# Altium schematic sheet HIVE_BOARD_ETHERNET.SchDoc
size Tabloid; SheetNumber: 9; SheetTotal: 12; Size: 11x17; Sheet_Name: ETHERNET
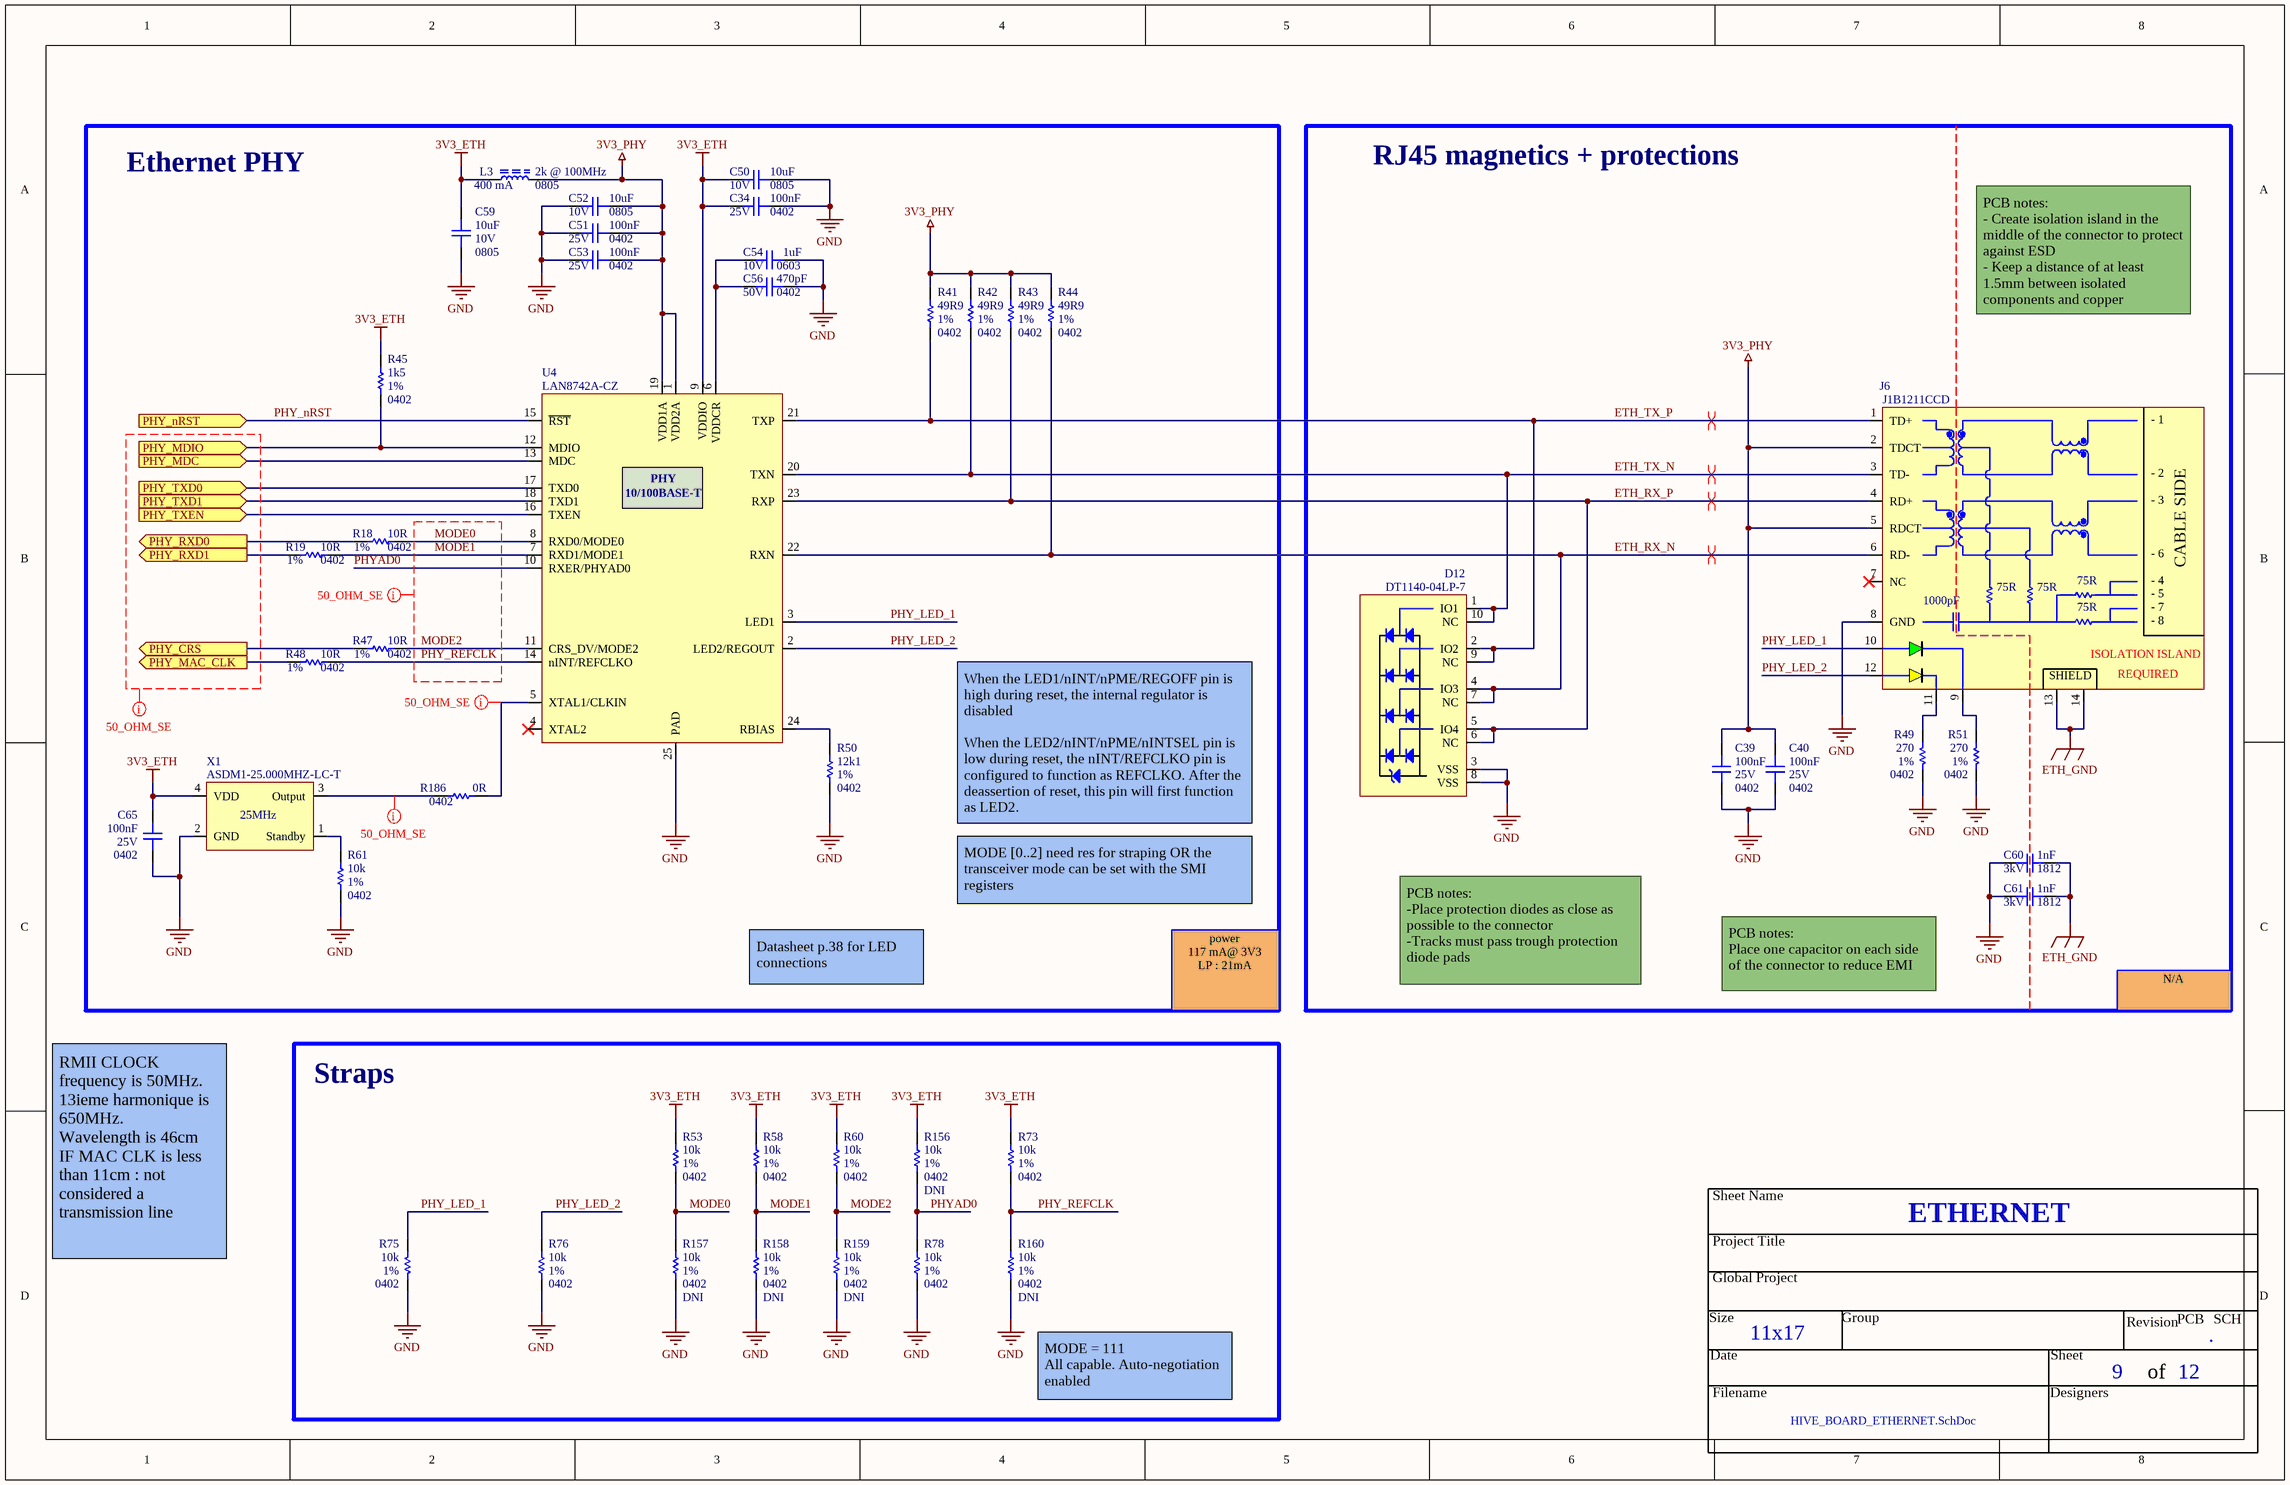
[diagram p0: HIVE_BOARD_ETHERNET.SchDoc]

## Parts
C34  value 100nF  Package: 0402  Voltage Rating: 25V  [CAP_CER_0402]  (hidden comment: CGA2B3X7R1E104K050BB)
C39  value 100nF  Package: 0402  Voltage Rating: 25V  [CAP_CER_0402]  (hidden comment: CGA2B3X7R1E104K050BB)
C40  value 100nF  Package: 0402  Voltage Rating: 25V  [CAP_CER_0402]  (hidden comment: CGA2B3X7R1E104K050BB)
C50  value 10uF  Package: 0805  Voltage Rating: 10V  [CAP_CER_0805]  (hidden comment: LMK212BJ106KG-T)
C51  value 100nF  Package: 0402  Voltage Rating: 25V  [CAP_CER_0402]  (hidden comment: CGA2B3X7R1E104K050BB)
C52  value 10uF  Package: 0805  Voltage Rating: 10V  [CAP_CER_0805]  (hidden comment: LMK212BJ106KG-T)
C53  value 100nF  Package: 0402  Voltage Rating: 25V  [CAP_CER_0402]  (hidden comment: CGA2B3X7R1E104K050BB)
C54  value 1uF  Package: 0603  Voltage Rating: 10V  [CAP_CER_0603]  (hidden comment: C0603C105K8PACTU)
C56  value 470pF  Package: 0402  Voltage Rating: 50V  [CAP_CER_0402]  (hidden comment: CC0402KRX7R9BB471)
C59  value 10uF  Package: 0805  Voltage Rating: 10V  [CAP_CER_0805]  (hidden comment: LMK212BJ106KG-T)
C60  value 1nF  Package: 1812  Voltage Rating: 3kV  [CAP_CER_1812]  (hidden comment: 885342211009)
C61  value 1nF  Package: 1812  Voltage Rating: 3kV  [CAP_CER_1812]  (hidden comment: 885342211009)
C65  value 100nF  Package: 0402  Voltage Rating: 25V  [CAP_CER_0402]  (hidden comment: CGA2B3X7R1E104K050BB)
D12  DT1140-04LP-7  [TVS_DATA_DT1140-04LP-7]
J6  J1B1211CCD  [CON_ETH_J1B1211CCD_WIZ]
L3  value 2k @ 100MHz  Current Rating: 400 mA  Package: 0805  [FER_0805]  (hidden comment: MMZ2012Y202BT000)
R18  value 10R  Tolerance: 1%  Package: 0402  [RES_0402]  (hidden comment: RMCF0402FT10R0)
R19  value 10R  Tolerance: 1%  Package: 0402  [RES_0402]  (hidden comment: RMCF0402FT10R0)
R41  value 49R9  Tolerance: 1%  Package: 0402  [RES_0402]  (hidden comment: RC0402FR-0749R9L)
R42  value 49R9  Tolerance: 1%  Package: 0402  [RES_0402]  (hidden comment: RC0402FR-0749R9L)
R43  value 49R9  Tolerance: 1%  Package: 0402  [RES_0402]  (hidden comment: RC0402FR-0749R9L)
R44  value 49R9  Tolerance: 1%  Package: 0402  [RES_0402]  (hidden comment: RC0402FR-0749R9L)
R45  value 1k5  Tolerance: 1%  Package: 0402  [RES_0402]  (hidden comment: RC0402FR-071K5L)
R47  value 10R  Tolerance: 1%  Package: 0402  [RES_0402]  (hidden comment: RMCF0402FT10R0)
R48  value 10R  Tolerance: 1%  Package: 0402  [RES_0402]  (hidden comment: RMCF0402FT10R0)
R49  value 270  Tolerance: 1%  Package: 0402  [FER_0402]  (hidden comment: RC0402FR-07270RL)
R50  value 12k1  Tolerance: 1%  Package: 0402  [RES_0402]  (hidden comment: RC0402FR-0712K1L)
R51  value 270  Tolerance: 1%  Package: 0402  [FER_0402]  (hidden comment: RC0402FR-07270RL)
R53  value 10k  Tolerance: 1%  Package: 0402  [RES_0402]  (hidden comment: RC0402FR-0710KL)
R58  value 10k  Tolerance: 1%  Package: 0402  [RES_0402]  (hidden comment: RC0402FR-0710KL)
R60  value 10k  Tolerance: 1%  Package: 0402  [RES_0402]  (hidden comment: RC0402FR-0710KL)
R61  value 10k  Tolerance: 1%  Package: 0402  [RES_0402]  (hidden comment: RC0402FR-0710KL)
R73  value 10k  Tolerance: 1%  Package: 0402  [RES_0402]  (hidden comment: RC0402FR-0710KL)
R75  value 10k  Tolerance: 1%  Package: 0402  [RES_0402]  (hidden comment: RC0402FR-0710KL)
R76  value 10k  Tolerance: 1%  Package: 0402  [RES_0402]  (hidden comment: RC0402FR-0710KL)
R78  value 10k  Tolerance: 1%  Package: 0402  [RES_0402]  (hidden comment: RC0402FR-0710KL)
R156  value 10k  Tolerance: 1%  Assembly Note: DNI  Package: 0402  [RES_0402]  (hidden comment: RC0402FR-0710KL)
R157  value 10k  Tolerance: 1%  Assembly Note: DNI  Package: 0402  [RES_0402]  (hidden comment: RC0402FR-0710KL)
R158  value 10k  Tolerance: 1%  Assembly Note: DNI  Package: 0402  [RES_0402]  (hidden comment: RC0402FR-0710KL)
R159  value 10k  Tolerance: 1%  Assembly Note: DNI  Package: 0402  [RES_0402]  (hidden comment: RC0402FR-0710KL)
R160  value 10k  Tolerance: 1%  Assembly Note: DNI  Package: 0402  [RES_0402]  (hidden comment: RC0402FR-0710KL)
R186  value 0R  Package: 0402  [RES_0402]  (hidden comment: RC0402FR-070RL)
U4  LAN8742A-CZ  [COM_ETH_LAN8742A-CZ-TR]
X1  ASDM1-25.000MHZ-LC-T  [OSC_CRY_ASDM1-25.000MHZ-LC-T]

## Blocks framed on the sheet
Ethernet PHY: C34 C50-C54 C56 C59 C65 L3 R18 R19 R41-R45 R47 R48 R50 R61 R186 U4 X1
RJ45 magnetics + protections: C39 C40 C60 C61 D12 J6 R49 R51
Straps: R53 R58 R60 R73 R75 R76 R78 R156-R160

## Ports
PHY_CRS (out), PHY_MAC_CLK (out), PHY_MDC (in), PHY_MDIO (in), PHY_nRST (in), PHY_RXD0 (out), PHY_RXD1 (out), PHY_TXD0 (in), PHY_TXD1 (in), PHY_TXEN (in)

## Nets
3V3_ETH: C34.2 C50.2 C59.2 C65.1 L3.1 R45.2 R53.2 R58.2 R60.2 R73.2 R156.2 U4.9(VDDIO) X1.4(VDD)
3V3_PHY: C39.1 C40.1 C51.1 C52.1 C53.1 J6.2(TDCT) J6.5(RDCT) L3.2 R41.2 R42.2 R43.2 R44.2 U4.1(VDD2A) U4.19(VDD1A)
ETH_GND: C60.1 C61.1 J6.13(SHIELD) J6.14
GND: C34.1 C39.2 C40.2 C50.1 C51.2 C52.2 C53.2 C54.1 C56.1 C59.1 C60.2 C61.2 C65.2 D12.3(VSS) D12.8(VSS) J6.8(GND) R49.1 R50.1 R51.1 R61.1 R75.1 R76.1 R78.1 R157.1 R158.1 R159.1 R160.1 U4.25(PAD) X1.2(GND)
ETH_RX_N: D12.4(IO3) D12.7(NC) J6.6(RD-) R44.1 U4.22(RXN)
ETH_RX_P: D12.5(IO4) D12.6(NC) J6.4(RD+) R43.1 U4.23(RXP)
ETH_TX_N: D12.1(IO1) D12.10(NC) J6.3(TD-) R42.1 U4.20(TXN)
ETH_TX_P: D12.2(IO2) D12.9(NC) J6.1(TD+) R41.1 U4.21(TXP)
MODE0: R18.1 R53.1 R157.2 U4.8(RXD0/MODE0)
MODE1: R19.1 R58.1 R158.2 U4.7(RXD1/MODE1)
MODE2: R47.1 R60.1 R159.2 U4.11(CRS_DV/MODE2)
PHY_CRS: R47.2 ; port PHY_CRS
PHY_LED_1: J6.10(LED1_A) R75.2 U4.3(LED1)
PHY_LED_2: J6.12 R76.2 U4.2(LED2/REGOUT)
PHY_MAC_CLK: R48.2 ; port PHY_MAC_CLK
PHY_MDC: U4.13(MDC) ; port PHY_MDC
PHY_MDIO: R45.1 U4.12(MDIO) ; port PHY_MDIO
PHY_nRST: U4.15(~{RST}) ; port PHY_nRST
PHY_REFCLK: R48.1 R73.1 R160.2 U4.14(nINT/REFCLKO)
PHY_RXD0: R18.2 ; port PHY_RXD0
PHY_RXD1: R19.2 ; port PHY_RXD1
PHY_TXD0: U4.17(TXD0) ; port PHY_TXD0
PHY_TXD1: U4.18(TXD1) ; port PHY_TXD1
PHY_TXEN: U4.16(TXEN) ; port PHY_TXEN
PHYAD0: R78.2 R156.1 U4.10(RXER/PHYAD0)
NetC54_2: C54.2 C56.2 U4.6(VDDCR)
NetJ6_9: J6.9(LED1_K) R51.2
NetJ6_11: J6.11 R49.2
NetR50_2: R50.2 U4.24(RBIAS)
NetR61_2: R61.2 X1.1(Standby)
NetR186_1: R186.1 U4.5(XTAL1/CLKIN)
NetR186_2: R186.2 X1.3(Output)

Not connected (* = marked no-connect by the designer): J6 7(NC)*; U4 4(XTAL2)*

## Layout directives
differential pair; differential pair class DIFF_100: ETH_RX_N, ETH_RX_P, ETH_TX_N, ETH_TX_P
net class SE_50: (no net found under the mark), MODE0, MODE1, MODE2, NetR186_1, NetR186_2, PHY_REFCLK

## Notes on the sheet
- PCB notes:
  - Create isolation island in the middle of the connector to protect against ESD
  - Keep a distance of at least 1.5mm between isolated components and copper
- When the LED1/nINT/nPME/REGOFF pin is high during reset, the internal regulator is disabled
  When the LED2/nINT/nPME/nINTSEL pin is low during reset, the nINT/REFCLKO pin is configured to function as REFCLKO. After the deassertion of reset, this pin will first function as LED2.
- MODE [0..2] need res for straping OR the transceiver mode can be set with the SMI registers
- Datasheet p.38 for LED connections
- power
  117 mA@ 3V3
  LP : 21mA
- PCB notes:
  -Place protection diodes as close as possible to the connector
  -Tracks must pass trough protection diode pads
- PCB notes:
  Place one capacitor on each side of the connector to reduce EMI
- N/A
- RMII CLOCK frequency is 50MHz. 13ieme harmonique is 650MHz.
  Wavelength is 46cm
  IF MAC CLK is less than 11cm : not considered a transmission line
- MODE = 111
  All capable. Auto-negotiation enabled
- Sheet Name
- Project Title
- Global Project
- Size
- Date
- Group
- Sheet
- Revision
- of
- PCB
- .
- SCH
- Filename
- Designers
- (in symbol COM_ETH_LAN8742A-CZ) PHY; 10/100BASE-T
- (in symbol CON_ETH_J1B1211CCD) - 1; - 2; - 3; - 6; CABLE SIDE; 75R; - 4; - 5; 1000pF; - 7; - 8; ISOLATION ISLAND; REQUIRED
- (in symbol OSC_CRY_ASDM1-25.000MHZ-LC-T) 25MHz

## Library data of the parts
C34 C39 C40 C51 C53 C65 = CAP_CER_CGA2B3X7R1E104K050BB: CAP - CER 0.1µF 10% 25V X7R - 0402; Manufacturer #1: TDK Corporation; GRAMS Lib Spec: 2.8; Magnetic Material: Unknown; Polarized: NO; Assembly Type: SMD; CreatedBy/Date: Nicolas Roy 2018-11-07; Current Rating: *; HelpURL: https://product.tdk.com/info/en/catalog/datasheets/mlcc_automotive_general_en.pdf; Manufacturer #2: *; Note: *; Part Number #1: CGA2B3X7R1E104K050BB; Part Number #2: *; Power Max: *; Temperature: -55°C ~ 125°C; Tolerance: 10%; VerifiedBy: Nicolas V. (2019-01-22); Supplier 1: Digi-Key; Supplier Part Number 1: 445-6902-1-ND; Cryo: UNKNOWN
C50 C52 C59 = CAP_CER_LMK212BJ106KG-T: CAP - CER 10UF 10% 10V X5R - 0805; Manufacturer #1: Taiyo Yuden; GRAMS Lib Spec: 2.8; Magnetic Material: Unknown; Polarized: NO; Assembly Type: SMD; CreatedBy/Date: Caroline Paulin / 25 juillet 2018; Current Rating: *; HelpURL: https://www.yuden.co.jp/productdata/catalog/mlcc_all_e.pdf; Manufacturer #2: *; Note: *; Part Number #1: LMK212BJ106KG-T; Part Number #2: *; Power Max: *; Temperature: -55°C ~ 85°C; Tolerance: 10%; VerifiedBy: Nicolas V. (2019-01-22); Supplier 1: Digi-Key; Supplier Part Number 1: 587-1300-1-ND; Cryo: UNKNOWN
C54 = CAP_CER_C0603C105K8PACTU: CAP - CER 1uF 10V 10% X5R - 0603; Manufacturer #1: KEMET; GRAMS Lib Spec: 2.8; Magnetic Material: Unknown; Polarized: NO; Tolerance: 10%; Current Rating: *; Power Max: *; HelpURL: https://content.kemet.com/datasheets/KEM_C1006_X5R_SMD.pdf; CreatedBy/Date: Hubert Dube - 21/07/20; VerifiedBy: Louis-Daniel Gaulin - 21/07/20; Temperature: -55°C ~ 85°C; Manufacturer #2: *; Assembly Type: SMD; Part Number #2: *; Part Number #1: C0603C105K8PACTU; Cryo: UNKNOWN; Supplier 1: Digi-Key; Supplier Part Number 1: 399-3118-1-ND
C56 = CAP_CER_CC0402KRX7R9BB471: CAP - CER 470pF 10% 50V X7R - 0402; Manufacturer #1: Yageo; GRAMS Lib Spec: 2.8; Magnetic Material: Unknown; Polarized: NO; Assembly Type: SMD; CreatedBy/Date: Nicolas Roy 2018-10-17; Current Rating: *; HelpURL: http://www.yageo.com/documents/recent/UPY-GPHC_X7R_6.3V-to-50V_18.pdf; Manufacturer #2: *; Part Number #1: CC0402KRX7R9BB471; Part Number #2: *; Power Max: *; Temperature: -55°C ~ 125°C; Tolerance: 10%; VerifiedBy: Caroline Paulin - 18 janv 2019; Supplier 1: Digi-Key; Supplier Part Number 1: 311-1028-1-ND; Cryo: UNKNOWN
C60 C61 = CAP_CER_885342211009: CAP - CER 1000pF ±10% 3000V X7R; Manufacturer #1: Würth Elektronik; GRAMS Lib Spec: 2.8; Magnetic Material: Unknown; Polarized: No; Tolerance: 10%; Current Rating: *; Power Max: *; HelpURL: https://www.we-online.de/katalog/datasheet/885342211009.pdf; CreatedBy/Date: Hubert Dube - 03/02/2021; VerifiedBy: Philippe Asenault - 08-02-2021; Temperature: -55°C ~ 125°C; Manufacturer #2: *; Note: *; Assembly Type: SMD; Part Number #2: *; Part Number #1: 885342211009; Cryo: UNKNOWN; Supplier 1: Digi-Key; Supplier Part Number 1: 732-12109-1-ND
D12 = TVS_DATA_DT1140-04LP-7: TVS - DIODE 5.5V 10V - 10-UFDFN; Manufacturer #1: Diodes Incorporated; Value: 5.5V @ 1mA (Reverse Standoff); Voltage Rating: 6V (Breakdown); Current Rating: 6A (8/20µs); Power Max: 60W (8/20µs); GRAMS Lib Spec: 2.8; Note: Fooprint created from tpd4e05u06 (TI) for manufacturability (soldermask); Magnetic Material: UNKNOWN; Polarized: Yes; Tolerance: -; HelpURL: https://www.diodes.com/assets/Datasheets/DT1140-04LP.pdf; CreatedBy/Date: Joël Lemay 2019-11-20; VerifiedBy: C.Paulin - 21/11/2019; Temperature: -55°C~85°C; Package: 10-UFDFN; Manufacturer #2: -; Assembly Type: SMD; Part Number #2: -; Part Number #1: DT1140-04LP-7; Supplier 1: Digi-Key; Supplier Part Number 1: DT1140-04LP-7DICT-ND; Cryo: UNKNOWN; Solder Paste Type: UNKNOWN; Stencil Thickness (Recommended): UNKNOWN
J6 = CON_ETH_J1B1211CCD: CON_ETH - 1 Port RJ45 Magjack Connector Through Hole 10/100 Base-T, AutoMDIX / 350 µH minimum OCL with 8 mA bias current.; Manufacturer #1: WIZnet; Part Number #1: 1278-1052-ND; GRAMS Lib Spec: 2.8; Magnetic Material: Unknown; Polarized: Yes; Tolerance: *; Voltage Rating: *; Power Max: *; HelpURL: http://wizwiki.net/wiki/lib/exe/fetch.php?media=products:wiz550web:wiz550webds_kr:j1b1211ccd.pdf; CreatedBy/Date: Hubert Dube - 12/02/2021; VerifiedBy: Philippe Arsenault - 2021-03-10; Temperature: -40°C ~ 85°C; Assembly Type: SMD; Part Number #2: *; Cryo: UNKNOWN; Supplier 1: Digi-Key; Supplier Part Number 1: 1278-1052-ND
L3 = FER_MMZ2012Y202BT000: FER - FERRITE BEAD 2 KOHM @ 100 MHz 400 mA - 0805; Manufacturer #1: TDK Corporation; GRAMS Lib Spec: 2.8; Magnetic Material: Unknown; Polarized: No; Tolerance: *; Voltage Rating: *; Power Max: *; HelpURL: https://product.tdk.com/info/en/catalog/datasheets/beads_commercial_signal_mmz2012_en.pdf; CreatedBy/Date: Hubert Dube - 7/02/2021; VerifiedBy: Philippe Arsenault/ 2021-03-13; Temperature: -55°C ~ 125°C; Assembly Type: SMD; Part Number #2: *; Part Number #1: MMZ2012Y202BT000; Cryo: UNKNOWN; Supplier 1: Digi-Key; Supplier Part Number 1: 445-1561-1-ND
R18 R19 R47 R48 = RES_RMCF0402FT10R0: RES - 10R 1% 1/16W - 0402; Manufacturer #1: Stackpole Electronics Inc.; Current Rating: 1A; GRAMS Lib Spec: 2.8; Magnetic Material: Unknown; Polarized: No; Voltage Rating: 50V; Assembly Type: SMD; CreatedBy/Date: Joel Lemay 2018-07-04; HelpURL: https://www.seielect.com/Catalog/SEI-RMCF_RMCP.pdf; Manufacturer #2: Panasonic; Part Number #1: RMCF0402FT10R0; Part Number #2: ERJ-2RKF10R0X; Power Max: 1/16W; Temperature: -55°C ~ 155°C; VerifiedBy: Caroline Paulin - 6 sept 2018; Supplier 1: Digi-Key; Supplier Part Number 1: RMCF0402FT10R0CT-ND; Cryo: UNKNOWN
R41-R44 = RES_RC0402FR-0749R9L: RES - 49.9 R ±1% 1/16W -  0402; Manufacturer #1: Yageo; GRAMS Lib Spec: 2.8c; Magnetic Material: Unknown; Polarized: No; Voltage Rating: 50V; Assembly Type: SMD; CreatedBy/Date: Hubert Dubé - 3/02/2020; Current Rating: *; HelpURL: https://www.yageo.com/upload/media/product/productsearch/datasheet/rchip/PYu-RC_Group_51_RoHS_L_11.pdf; Manufacturer #2: *; Note: *; Part Number #1: RC0402FR-0749R9L; Part Number #2: *; Power Max: 1/16W; Temperature: -55°C ~ 155°C; VerifiedBy: Philippe Arsenault/2021-02-08; Supplier 1: Digi-Key; Supplier Part Number 1: 311-49.9LRCT-ND
R45 = RES_RC0402FR-071K5L: RES - 1.5K 1% 1/16W - 0402; Manufacturer #1: Yageo; GRAMS Lib Spec: 2.8c; Magnetic Material: Unknown; Polarized: No; Voltage Rating: 50V; Assembly Type: SMD; CreatedBy/Date: Philippe Arsenault/21 Janvier 2020; Current Rating: -; HelpURL: https://www.yageo.com/upload/media/product/productsearch/datasheet/rchip/PYu-RC_Group_51_RoHS_L_10.pdf; Manufacturer #2: -; Note: -; Part Number #1: RC0402FR-071K5L; Part Number #2: -; Power Max: 1/16W; Temperature: -55°C ~ 155°C; VerifiedBy: C.Paulin - 28/01/2020; Supplier 1: Digi-Key; Supplier Part Number 1: 311-1.50KLRCT-ND; Cryo: UNKNOWN
R49 R51 = RES_RC0402FR-07270RL: RES - 270R 1% 1/16W - 0402; Manufacturer #1: Yageo; GRAMS Lib Spec: 2.8c; Magnetic Material: Unknown; Polarized: No; Voltage Rating: 50V; Assembly Type: SMD; CreatedBy/Date: Philippe Arsenault 2020-07-24; Current Rating: *; HelpURL: https://www.yageo.com/upload/media/product/productsearch/datasheet/rchip/PYu-RC_Group_51_RoHS_L_10.pdf; Manufacturer #2: *; Note: *; Part Number #1: RC0402FR-07270RL; Part Number #2: *; Power Max: 1/16W; Temperature: -55°C ~ 155°C; VerifiedBy: Louis-Daniel Gaulin / 03-10-2020; Supplier 1: Digi-Key; Supplier Part Number 1: 311-270LRCT-ND
R50 = RES_RC0402FR-0712K1L: RES - 12K1 ±1% 1/16W - 0402; Manufacturer #1: Yageo; GRAMS Lib Spec: 2.8c; Magnetic Material: Unknown; Polarized: No; Voltage Rating: 50V; Assembly Type: SMD; CreatedBy/Date: Hubert Dubé - 7/02/2020; Current Rating: *; HelpURL: https://www.yageo.com/upload/media/product/productsearch/datasheet/rchip/PYu-RC_Group_51_RoHS_L_11.pdf; Manufacturer #2: *; Note: *; Part Number #1: RC0402FR-0712K1L; Part Number #2: *; Power Max: 1/16W; Temperature: -55°C ~ 155°C; VerifiedBy: Philippe Arsenault/2021-02-08; Supplier 1: Digi-Key; Supplier Part Number 1: 311-12.1KLRCT-ND
R53 R58 R60 R61 R73 R75 R76 R78 R156-R160 = RES_RC0402FR-0710KL: RES - 10K OHMS 1% 1/16W - 0402; Manufacturer #1: Yageo; GRAMS Lib Spec: 2.8; Magnetic Material: UNKNOWN; Polarized: NO; Voltage Rating: 50V; Assembly Type: SMD; CreatedBy/Date: Nicolas V. (2018-11-20); Current Rating: *; HelpURL: http://www.yageo.com/documents/recent/PYu-RC_Group_51_RoHS_L_9.pdf; Manufacturer #2: *; Note: *; Part Number #1: RC0402FR-0710KL; Part Number #2: *; Power Max: 1/16W; Temperature: -55°C ~ 155°C; VerifiedBy: Nicolas V. (2018-11-20); Supplier 1: Digi-Key; Supplier Part Number 1: 311-10.0KLRCT-ND; Cryo: UNKNOWN
R186 = RES_RC0402FR-070RL: RES - 0R 1/16W 1A  - 0402; Manufacturer #1: Yageo; GRAMS Lib Spec: 2.8; Magnetic Material: Unknown; Polarized: No; Voltage Rating: 50V; Assembly Type: SMD; CreatedBy/Date: Keven Deslandes 2018-09-12; Current Rating: 1A; HelpURL: http://www.yageo.com/documents/recent/PYu-RC_Group_51_RoHS_L_10.pdf; Manufacturer #2: *; Note: *; Part Number #1: RC0402FR-070RL; Part Number #2: *; Power Max: 1/16W; Temperature: -55°C ~ 155°C; VerifiedBy: Caroline Paulin - 27 fév 2019; Supplier 1: Digi-Key; Supplier Part Number 1: 311-0.0LRCT-ND; Cryo: UNKNOWN
U4 = COM_ETH_LAN8742A-CZ: COM_ETH_ Ethernet PHY 1/1 Transceiver  Ethernet 24-SQFN (4x4) 10/100 BASE-T; Manufacturer #1: Microchip Technology; Voltage Rating: 1.6 ~ 3.6V; GRAMS Lib Spec: 2.7; Magnetic Material: Unknown; Polarized: Yes; Value: *; Tolerance: *; Current Rating: *; Power Max: *; HelpURL: https://ww1.microchip.com/downloads/en/DeviceDoc/DS_LAN8742_00001989A.pdf; VerifiedBy: Philippe Arsenault 2021-03-10; Temperature: 0°C ~ 70°C; Package: 24-SQFN (4x4); Manufacturer #2: *; Note: *; Assembly Type: SMD; Part Number #2: *; Part Number #1: LAN8742A-CZ; CreatedBy/Date: Hubert Dube -  28/01/2021; Supplier 1: Digi-Key; Supplier Part Number 1: LAN8742A-CZ-ND
X1 = OSC_CRY_ASDM1-25.000MHZ-LC-T: OSC_CRY - 25MHz +-50ppm LVCMOS Crystal; Manufacturer #1: Abracon LLC; Voltage Rating: 3.0 ~ 3.6V; Current Rating: 15mA; Power Max: 50mW; GRAMS Lib Spec: 2.8; Magnetic Material: Unknown; Polarized: YES; Value: 25.000MHz; HelpURL: https://abracon.com/Oscillators/ASDM.pdf; CreatedBy/Date: Philippe Arsenault/2021-04-07; VerifiedBy: Louis-Daniel Gaulin / 08-04-2021; Temperature: -40°C ~ 85°C; Package: 4-SMD; Assembly Type: SMD; Part Number #1: ASDM1-25.000MHZ-LC-T; Supplier 1: Digi-Key; Supplier Part Number 1: 535-9792-1-ND